# EAGLE schematic Microcontroller_STM_STM32F373CC (EAGLE 6.5.0)
Microcontroller: STM32F373CC STM32F373CC <http://www.st.com/internet/com/TECHNICAL_RESOURCES/TECHNICAL_LITERATURE/DATASHEET/DM00046749.pdf> This sheet contains the microcontroller with oscillator, and all required capacitors. Capacitors C_MC_VDDSD_X and C_MC_VREFDC_X are required when using Sigma Delta A2D, optional otherwise Capacitor C_MC_VDDA_1 is required when using A2D, optional otherwise
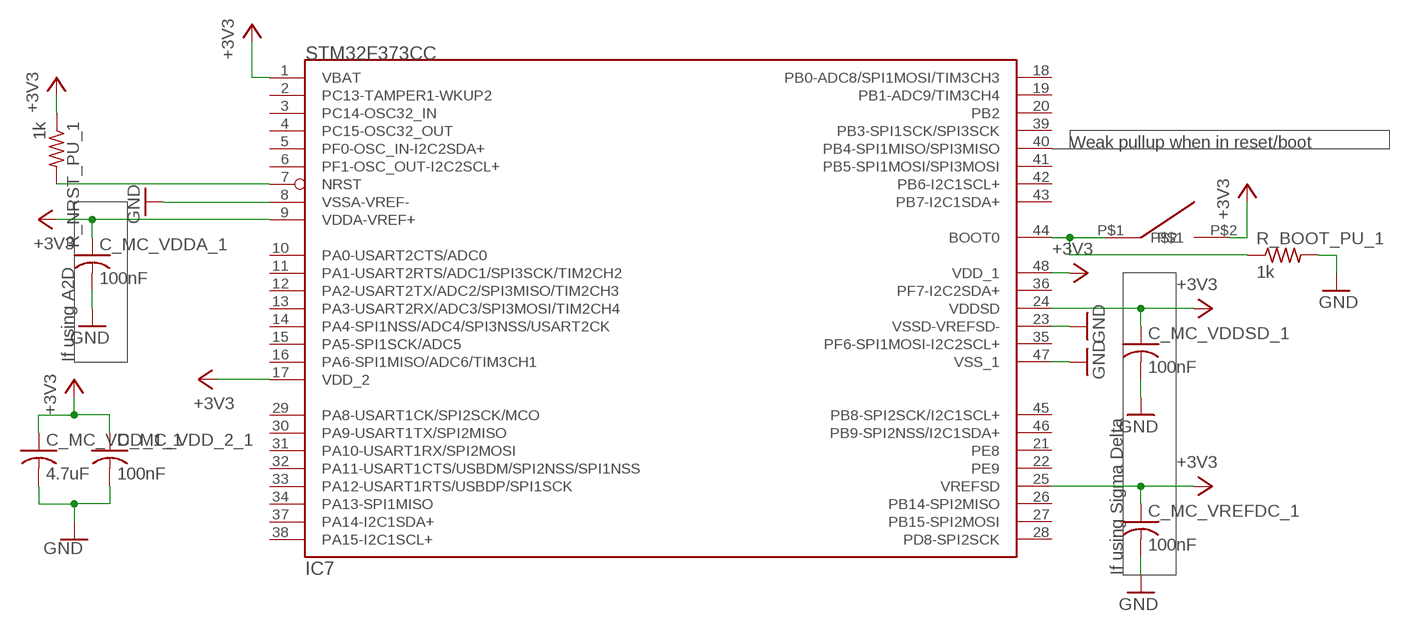
[diagram p0: schematic, sheet 1]

## Parts
C_MC_VDD_1_1  4.7uF  C-USC0603  [C0603]
C_MC_VDD_2_1  100nF  C-USC0603  [C0603]
C_MC_VDDA_1  100nF  C-USC0603  [C0603]
C_MC_VDDSD_1  100nF  C-USC0603  [C0603]
C_MC_VREFDC_1  100nF  C-USC0603  [C0603]
IC7  STM32F373CC  [LQFP48]
R_BOOT_PU_1  1k  R-US_R0603  [R0603]
R_NRST_PU_1  1k  R-US_R0603  [R0603]
SW1  B3U  [B3U]

## Nets
+3V3: C_MC_VDD_1_1.1 C_MC_VDD_2_1.1 C_MC_VDDA_1.1 C_MC_VDDSD_1.1 C_MC_VREFDC_1.1 IC7.1(VBAT) IC7.9(VDDA-VREF+) IC7.17(VDD_2) IC7.24(VDDSD) IC7.25(VREFSD) IC7.48(VDD_1) R_NRST_PU_1.1 SW1.P$2
BOOT0_1: IC7.44(BOOT0) R_BOOT_PU_1.1 SW1.P$1
GND: C_MC_VDD_1_1.2 C_MC_VDD_2_1.2 C_MC_VDDA_1.2 C_MC_VDDSD_1.2 C_MC_VREFDC_1.2 IC7.8(VSSA-VREF-) IC7.23(VSSD-VREFSD-) IC7.47(VSS_1) R_BOOT_PU_1.2
NRST_1: IC7.7(NRST) R_NRST_PU_1.2
Unconnected: IC7.2(PC13-TAMPER1-WKUP2) IC7.3(PC14-OSC32_IN) IC7.4(PC15-OSC32_OUT) IC7.5(PF0-OSC_IN-I2C2SDA+) IC7.6(PF1-OSC_OUT-I2C2SCL+) IC7.10(PA0-USART2CTS/ADC0) IC7.11(PA1-USART2RTS/ADC1/SPI3SCK/TIM2CH2) IC7.12(PA2-USART2TX/ADC2/SPI3MISO/TIM2CH3) IC7.13(PA3-USART2RX/ADC3/SPI3MOSI/TIM2CH4) IC7.14(PA4-SPI1NSS/ADC4/SPI3NSS/USART2CK) IC7.15(PA5-SPI1SCK/ADC5) IC7.16(PA6-SPI1MISO/ADC6/TIM3CH1) IC7.18(PB0-ADC8/SPI1MOSI/TIM3CH3) IC7.19(PB1-ADC9/TIM3CH4) IC7.20(PB2) IC7.21(PE8) IC7.22(PE9) IC7.26(PB14-SPI2MISO) IC7.27(PB15-SPI2MOSI) IC7.28(PD8-SPI2SCK) IC7.29(PA8-USART1CK/SPI2SCK/MCO) IC7.30(PA9-USART1TX/SPI2MISO) IC7.31(PA10-USART1RX/SPI2MOSI) IC7.32(PA11-USART1CTS/USBDM/SPI2NSS/SPI1NSS) IC7.33(PA12-USART1RTS/USBDP/SPI1SCK) IC7.34(PA13-SPI1MISO) IC7.35(PF6-SPI1MOSI-I2C2SCL+) IC7.36(PF7-I2C2SDA+) IC7.37(PA14-I2C1SDA+) IC7.38(PA15-I2C1SCL+) IC7.39(PB3-SPI1SCK/SPI3SCK) IC7.40(PB4-SPI1MISO/SPI3MISO) IC7.41(PB5-SPI1MOSI/SPI3MOSI) IC7.42(PB6-I2C1SCL+) IC7.43(PB7-I2C1SDA+) IC7.45(PB8-SPI2SCK/I2C1SCL+) IC7.46(PB9-SPI2NSS/I2C1SDA+)

## Notes on the sheet
- Weak pullup when in reset/boot
- If using A2D
- If using Sigma Delta

## Library data of the parts
C_MC_VDD_1_1 C_MC_VDD_2_1 C_MC_VDDA_1 C_MC_VDDSD_1 C_MC_VREFDC_1 = resistor:C-US: CAPACITOR, American symbol
IC7 = neels:STM32F373CC
R_BOOT_PU_1 R_NRST_PU_1 = resistor:R-US_: RESISTOR, American symbol
SW1 = zz-upenn:B3U